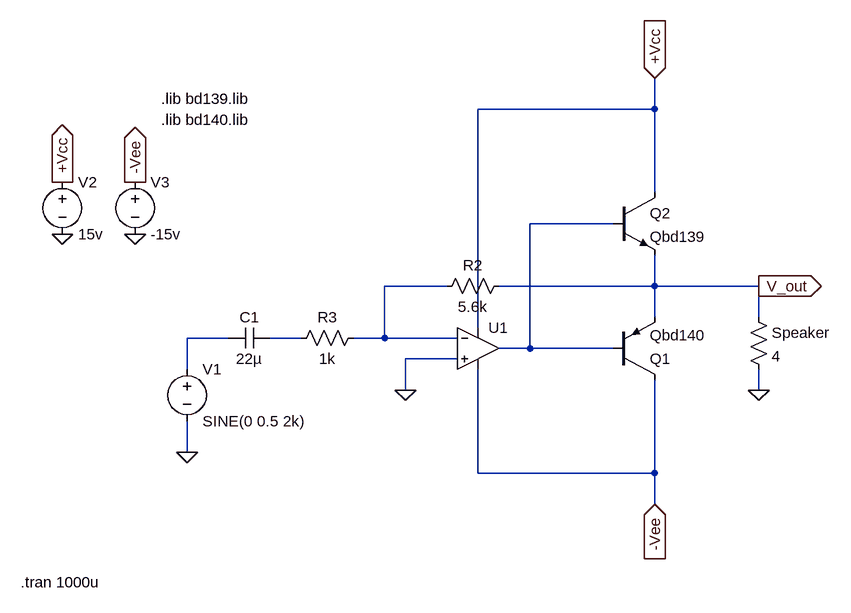
[diagram p0: schematic Class B amplifier.asc]
Class B amplifier.asc, the LTspice schematic file:
Version 4.1
SHEET 1 880 680
WIRE 272 -144 272 -192
WIRE 272 -144 0 -144
WIRE 272 -16 272 -144
WIRE 208 32 80 32
WIRE -48 128 -144 128
WIRE 272 128 272 80
WIRE 272 128 32 128
WIRE 432 128 272 128
WIRE 272 176 272 128
WIRE 432 176 432 128
WIRE 0 192 0 -144
WIRE -384 208 -448 208
WIRE -272 208 -320 208
WIRE -144 208 -144 128
WIRE -144 208 -192 208
WIRE -32 208 -144 208
WIRE 80 224 80 32
WIRE 80 224 32 224
WIRE 208 224 80 224
WIRE -32 240 -112 240
WIRE -448 256 -448 208
WIRE -112 288 -112 240
WIRE 432 288 432 256
WIRE -448 384 -448 336
WIRE 0 416 0 256
WIRE 272 416 272 272
WIRE 272 416 0 416
WIRE 272 464 272 416
FLAG 432 128 V_out
IOPIN 432 128 Out
FLAG -112 288 0
FLAG 432 288 0
FLAG -448 384 0
FLAG -640 48 0
FLAG -528 48 0
FLAG -640 -32 +Vcc
IOPIN -640 -32 Out
FLAG -528 -32 -Vee
IOPIN -528 -32 Out
FLAG 272 -192 +Vcc
IOPIN 272 -192 In
FLAG 272 464 -Vee
IOPIN 272 464 In
SYMBOL pnp 208 272 M180
SYMATTR InstName Q1
SYMATTR Value Qbd140
SYMBOL npn 208 -16 R0
SYMATTR InstName Q2
SYMATTR Value Qbd139
SYMBOL res 416 160 R0
SYMATTR InstName Speaker
SYMATTR Value 4
SYMBOL OpAmps\\UniversalOpAmp2 0 224 R0
SYMATTR InstName U1
SYMBOL res 48 112 R90
WINDOW 0 0 56 VBottom 2
WINDOW 3 32 56 VTop 2
SYMATTR InstName R2
SYMATTR Value 5.6k
SYMBOL res -176 192 R90
WINDOW 0 0 56 VBottom 2
WINDOW 3 32 56 VTop 2
SYMATTR InstName R3
SYMATTR Value 1k
SYMBOL voltage -448 240 R0
WINDOW 123 0 0 Left 0
WINDOW 39 0 0 Left 0
SYMATTR InstName V1
SYMATTR Value SINE(0 0.5 2k)
SYMBOL voltage -640 -48 R0
SYMATTR InstName V2
SYMATTR Value 15v
SYMBOL voltage -528 -48 R0
SYMATTR InstName V3
SYMATTR Value -15v
SYMBOL cap -320 192 R90
WINDOW 0 0 32 VBottom 2
WINDOW 3 32 32 VTop 2
SYMATTR InstName C1
SYMATTR Value 22µ
TEXT -488 -160 Left 2 !.lib bd139.lib
TEXT -488 -128 Left 2 !.lib bd140.lib
TEXT -704 584 Left 2 !.tran 1000u

The netlist it stands for:
* Class B amplifier.asc
Q1 -Vee N001 V_out 0 Qbd140
Q2 +Vcc N001 V_out 0 Qbd139
R§Speaker V_out 0 4
X§U1 0 N002 +Vcc -Vee N001 level2 Avol=1Meg GBW=10Meg Slew=10Meg Ilimit=25m Rail=0 Vos=0 En=0 Enk=0 In=0 Ink=0 Rin=500Meg  ; pins In+ In- V+ V- OUT
R2 V_out N002 5.6k
R3 N002 N004 1k
V1 N003 0 SINE(0 0.5 2k)
V2 +Vcc 0 15v
V3 -Vee 0 -15v
C1 N004 N003 22µ
.model NPN NPN
.model PNP PNP
.lib standard.bjt
.lib bd139.lib
.lib bd140.lib
.tran 1000u
.lib UniversalOpAmp2.lib
.backanno
.end